# EAGLE design GSM Schematic (EAGLE 7.7.0)
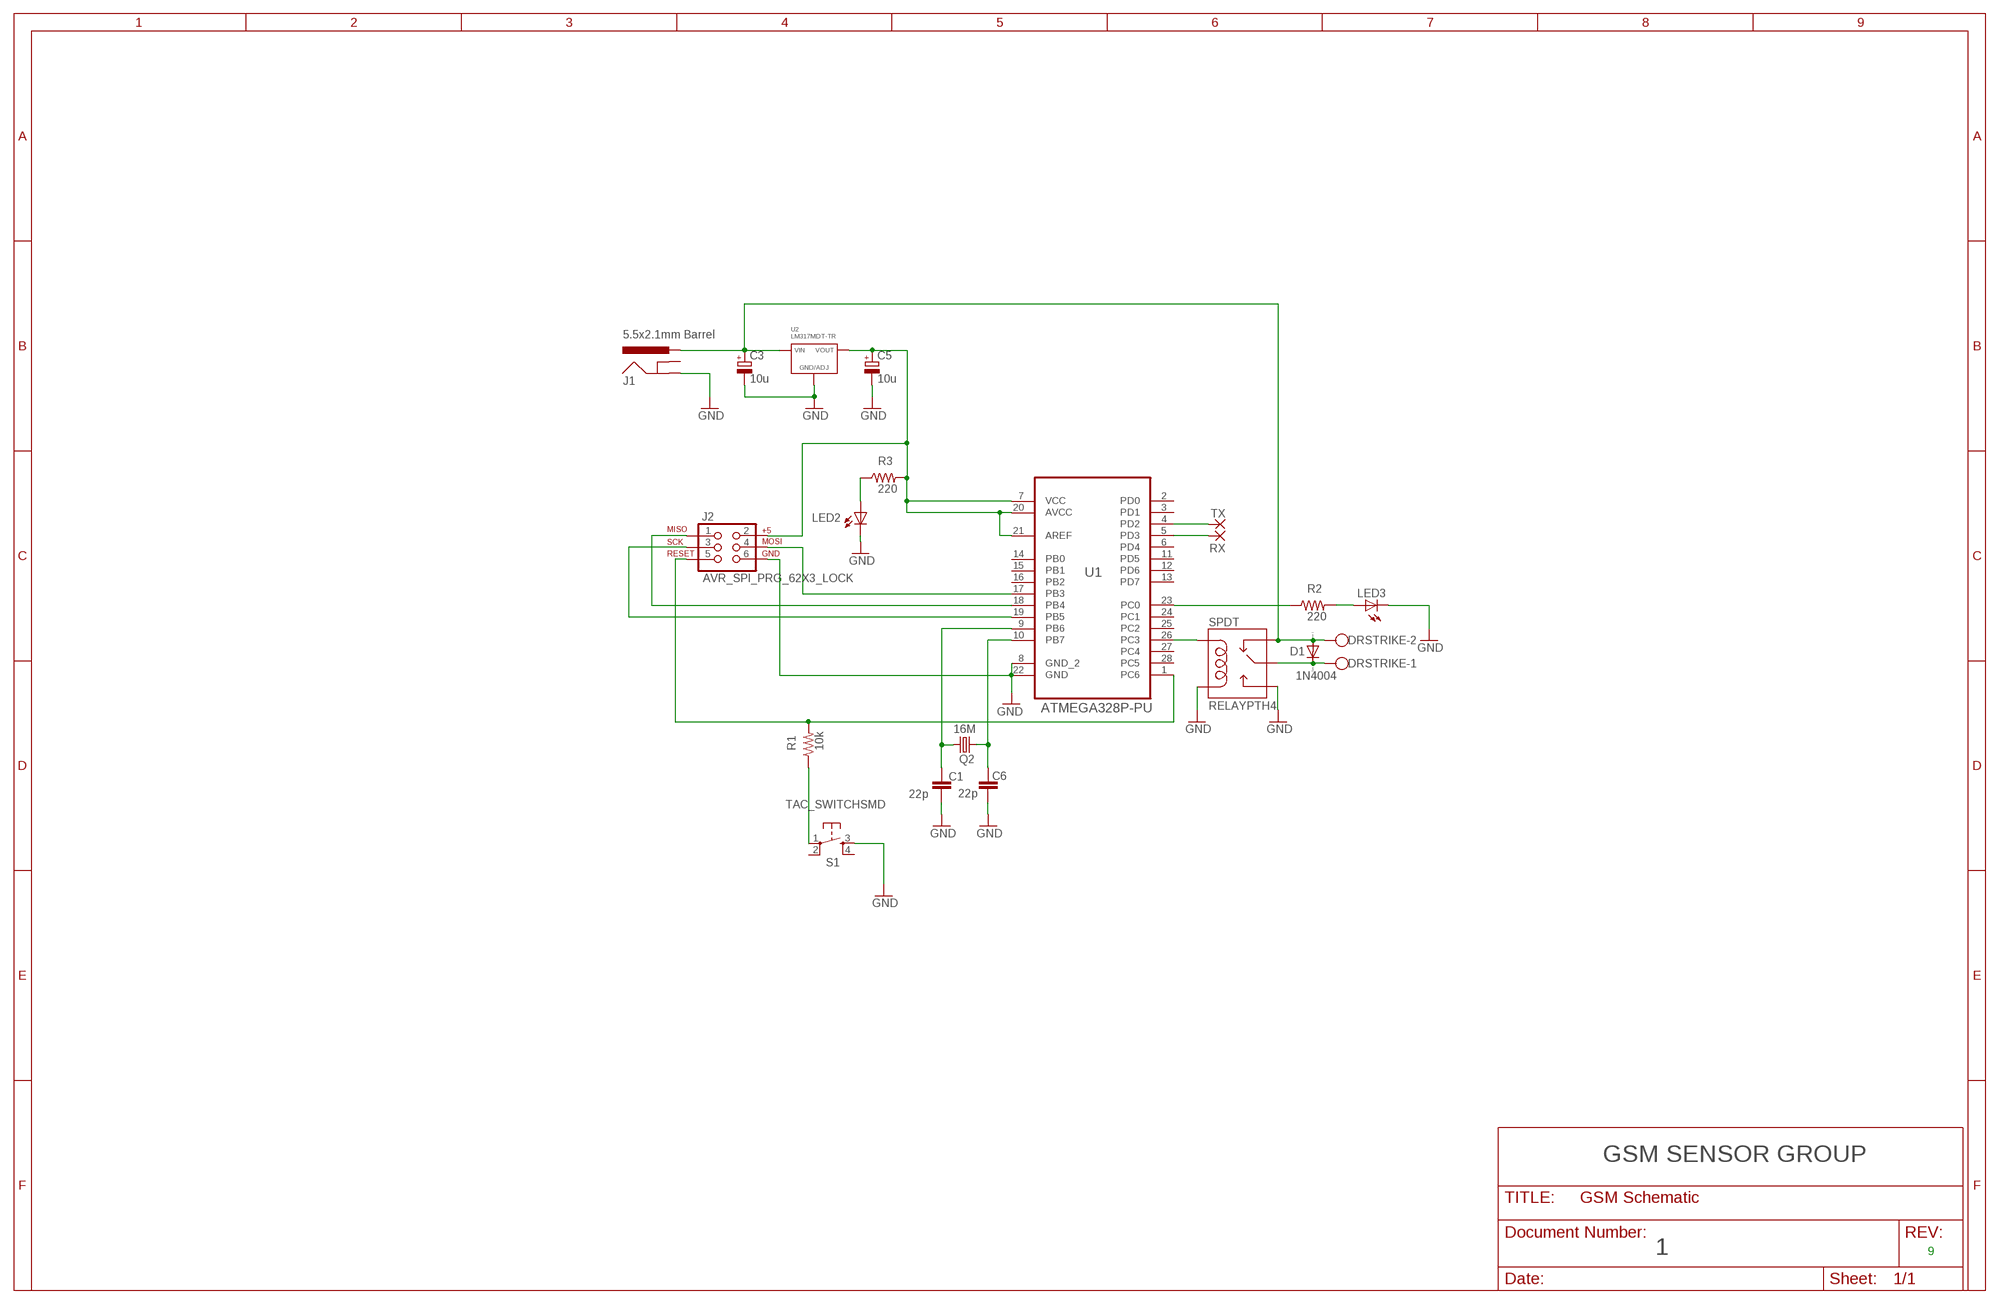
[diagram p0: schematic, sheet 1]

## Parts
C1  22p  C-EUC0603  [C0603]
C3  10u  CPOL-EUE5-10.5  [E5-10,5]
C5  10u  CPOL-EUE5-10.5  [E5-10,5]
C6  22p  C-EUC0603  [C0603]
D1  1N4004  [DO41-10]
DRSTRIKE  W237-102  [W237-102]
J1  5.5x2.1mm Barrel  POWER_JACKSMD  [POWER_JACK_SMD]
J2  AVR_SPI_PRG_62X3_LOCK  [2X3_LOCK]
LED2  LEDSML0603  [SML0603]
LED3  LED5MM  [LED5MM]
Q2  16M  CRYSTALHC49UP  [HC49UP]
R1  10k  R-US_R0603  [R0603]
R2  220  R-US_R0603  [R0603]
R3  220  R-US_R0603  [R0603]
RX  2,54/0,9  [2,54/0,9]
S1  TAC_SWITCHSMD  [TACTILE-SWITCH-SMD]
SPDT  RELAYPTH4  [RELAY-JZC]
TX  2,54/0,9  [2,54/0,9]
U1  ATMEGA328P-PU  [DIP254P762X457-28]
U2  LM317MDT-TR  [TO-252-3]

## Nets
5V: C5.+ J2.2 R3.2 U1.7(VCC) U1.20(AVCC) U1.21(AREF) U2.PAD(VOUT)
12V: C3.+ D1.A DRSTRIKE.2 J1.VIN0(PWR) SPDT.2(NC) U2.2(VIN)
GND: C1.2 C3.- C5.- C6.2 J1.P$4(GND) J2.6 LED2.C LED3.K(C) S1.3 SPDT.1(COIL2) SPDT.3(NO) U1.8(GND_2) U1.22(GND) U2.1(GND/ADJ)
N$1: TX.1(P) U1.4(PD2)
N$2: R1.1 S1.1
N$3: LED2.A R3.1
N$4: D1.C DRSTRIKE.1 SPDT.4(MAIN)
N$5: J2.3 U1.19(PB5)
N$6: LED3.A R2.2
N$7: J2.4 U1.17(PB3)
N$8: J2.1 U1.18(PB4)
N$9: R2.1 U1.23(PC0)
N$10: J2.5 R1.2 U1.1(PC6)
N$12: RX.1(P) U1.5(PD3)
N$14: SPDT.5(COIL1) U1.26(PC3)
N$16: C1.1 Q2.2 U1.9(PB6)
N$18: C6.1 Q2.1 U1.10(PB7)
Unconnected: J1.GND(GNDBREAK) S1.2 S1.4 U1.2(PD0) U1.3(PD1) U1.6(PD4) U1.11(PD5) U1.12(PD6) U1.13(PD7) U1.14(PB0) U1.15(PB1) U1.16(PB2) U1.24(PC1) U1.25(PC2) U1.27(PC4) U1.28(PC5)

## Notes on the sheet
- GSM SENSOR GROUP
- 1 | 9

## Library data of the parts
C1 C6 = rcl:C-EU: CAPACITOR, European symbol
C3 C5 = rcl:CPOL-EU: POLARIZED CAPACITOR, European symbol
D1 = diode:1N4004: DIODE general purpose rectifier, 1 A
DRSTRIKE = con-wago-500:W237-102: WAGO SCREW CLAMP; MPN: 237-102; OC_FARNELL: unknown; OC_NEWARK: 70K9898
J1 = SparkFun-Connectors:POWER_JACK: Power Jack This is the standard 5.5mm barrel jack for power. The PTH is the most common, proven, reliable, footprint. The Slot footprint only works if the mill layer is transmitted to the PCB fab house so be warned. Mating wall wart : TOL-00298 (and others); PROD_ID: CONN-08106; SF_ID: PRT-12748
J2 = SparkFun-Connectors:AVR_SPI_PRG_6: AVR ISP 6 Pin This is the reduced ISP connector for AVR programming. Common on Arduino. This footprint will take up less PCB space and can be used with a 10-pin to 6-pin adapter such as SKU: BOB-08508 **Special note about "TEST_POINT" package. The stop mask is on the top side, so if you want your programming test points to be on the bottom of your board, make sure to place this package on the bottom side of the board. This also ensure that the orientation to program from the bottom side will be correct.
LED2 LED3 = led:LED: LED OSRAM: - CHIPLED LG R971, LG N971, LY N971, LG Q971, LY Q971, LO R971, LY R971 LH N974, LH R974 LS Q976, LO Q976, LY Q976 LO Q996 - Hyper CHIPLED LW Q18S LB Q993, LB Q99A, LB R99A - SideLED LS A670, LO A670, LY A670, LG A670, LP A670 LB A673, LV A673, LT A673, LW A673 LH A674 LY A675 LS A676, LA A676, LO A676, LY A676, LW A676 LS A679, LY A679, LG A679 - Hyper Micro SIDELED® LS Y876, LA Y876, LO Y876, LY Y876 LT Y87S - SmartLED LW L88C, LW L88S LB L89C, LB L89S, LG L890 LS L89K, LO L89K, LY L89K LS L896, LA L896, LO L896, LY L896 - TOPLED LS T670, LO T670, LY T670, LG T670, LP T670 LSG T670, LSP T670, LSY T670, LOP T670, LYG T670 LG T671, LOG T671, LSG T671 LB T673, LV T673, LT T673, LW T673 LH T674 LS T676, LA T676, LO T676, LY T676, LB T676, LH T676, LSB T676, LW T676 LB T67C, LV T67C, LT T67C, LS T67K, LO T67K, LY T67K, LW E67C LS E67B, LA E67B, LO E67B, LY E67B, LB E67C, LV E67C, LT E67C LW T67C LS T679, LY T679, LG T679 LS T770, LO T770, LY T770, LG T770, LP T770 LB T773, LV T773, LT T773, LW T773 LH T774 LS E675, LA E675, LY E675, LS T675 LS T776, LA T776, LO T776, LY T776, LB T776 LHGB T686 LT T68C, LB T68C - Hyper Mini TOPLED® LB M676 - Mini TOPLED Santana® LG M470 LS M47K, LO M47K, LY M47K Source: http://www.osram.convergy.de LUXEON: - LUMILED® LXK2-PW12-R00, LXK2-PW12-S00, LXK2-PW14-U00, LXK2-PW14-V00 LXK2-PM12-R00, LXK2-PM12-S00, LXK2-PM14-U00 LXK2-PE12-Q00, LXK2-PE12-R00, LXK2-PE12-S00, LXK2-PE14-T00, LXK2-PE14-U00 LXK2-PB12-K00, LXK2-PB12-L00, LXK2-PB12-M00, LXK2-PB14-N00, LXK2-PB14-P00, LXK2-PB14-Q00 LXK2-PR12-L00, LXK2-PR12-M00, LXK2-PR14-Q00, LXK2-PR14-R00 LXK2-PD12-Q00, LXK2-PD12-R00, LXK2-PD12-S00 LXK2-PH12-R00, LXK2-PH12-S00 LXK2-PL12-P00, LXK2-PL12-Q00, LXK2-PL12-R00 Source: www.luxeon.com KINGBRIGHT: KA-3528ASYC Source: www.kingbright.com
Q2 = crystal:CRYSTAL: CRYSTAL; OC_FARNELL: unknown; OC_NEWARK: unknown
R1-R3 = rcl:R-US_: RESISTOR, American symbol
RX TX = wirepad:2,54/0,9: THROUGH-HOLE PAD
S1 = SparkFun-Retired:TAC_SWITCH: Momentary Switch Button commonly used for reset or general input. Spark Fun Electronics SKU : COM-00097 SMT- SWCH-08247; PROD_ID: SWCH-08247
SPDT = SparkFun-Electromechanical:RELAY: SPDT relay (COM-00101)
U1 = Atmel_By_element14_Batch_1-00:ATMEGA328P-PU: 8-bit Microcontroller with In-System Programmable Flash; MPN: ATMEGA328P-PU; OC_FARNELL: 1715487; OC_NEWARK: 15R0268; PACKAGE: PDIP-28; SUPPLIER: Atmel
U2 = MF_IC_Power:LM317: Manufacturer Part #: LM317 Manufacturer: STMicroelectronics Description: Linear Voltage Regulators 1.2-37V Adj Positive; HOUSEPART: NO; MPN: LM317MDT-TR; POPULATE: 1; URL: http://www.st.com/content/ccc/resource/technical/document/datasheet/8e/b2/ea/56/ad/8c/43/d8/CD00000549.pdf/files/CD00000549.pdf/jcr:content/translations/en.CD00000549.pdf

## Board
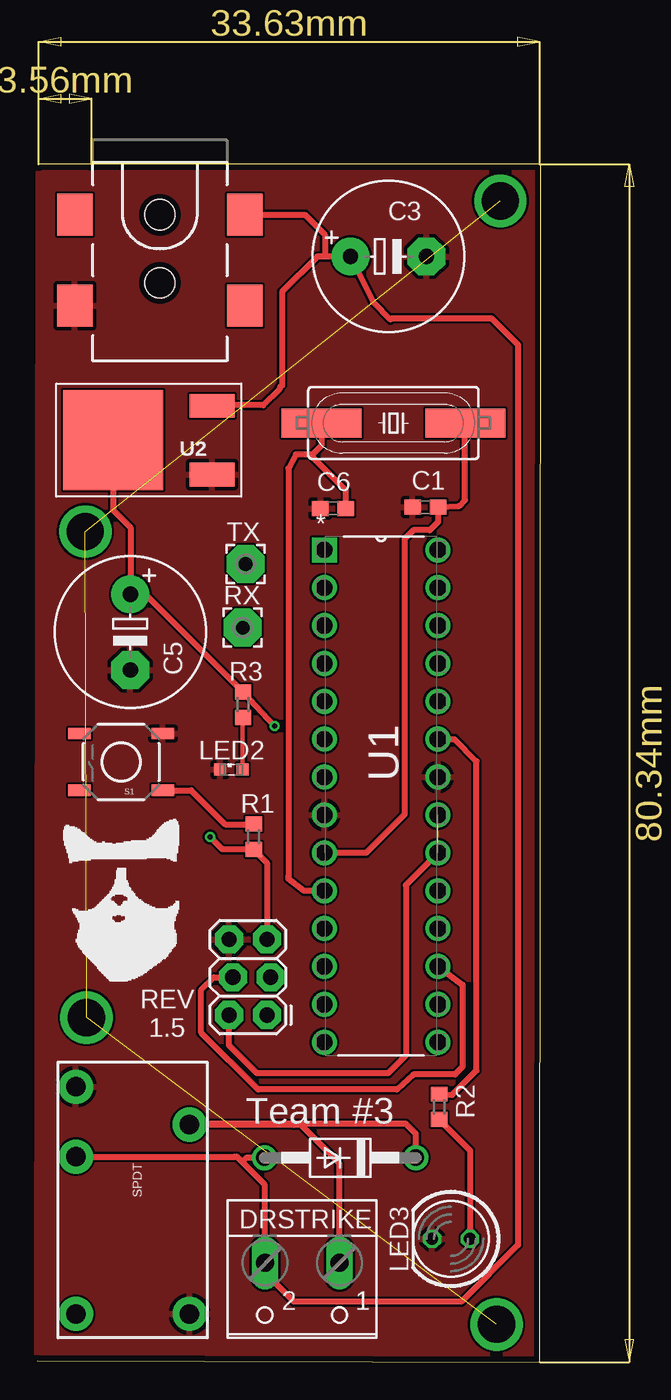
[diagram p1: board, top side]
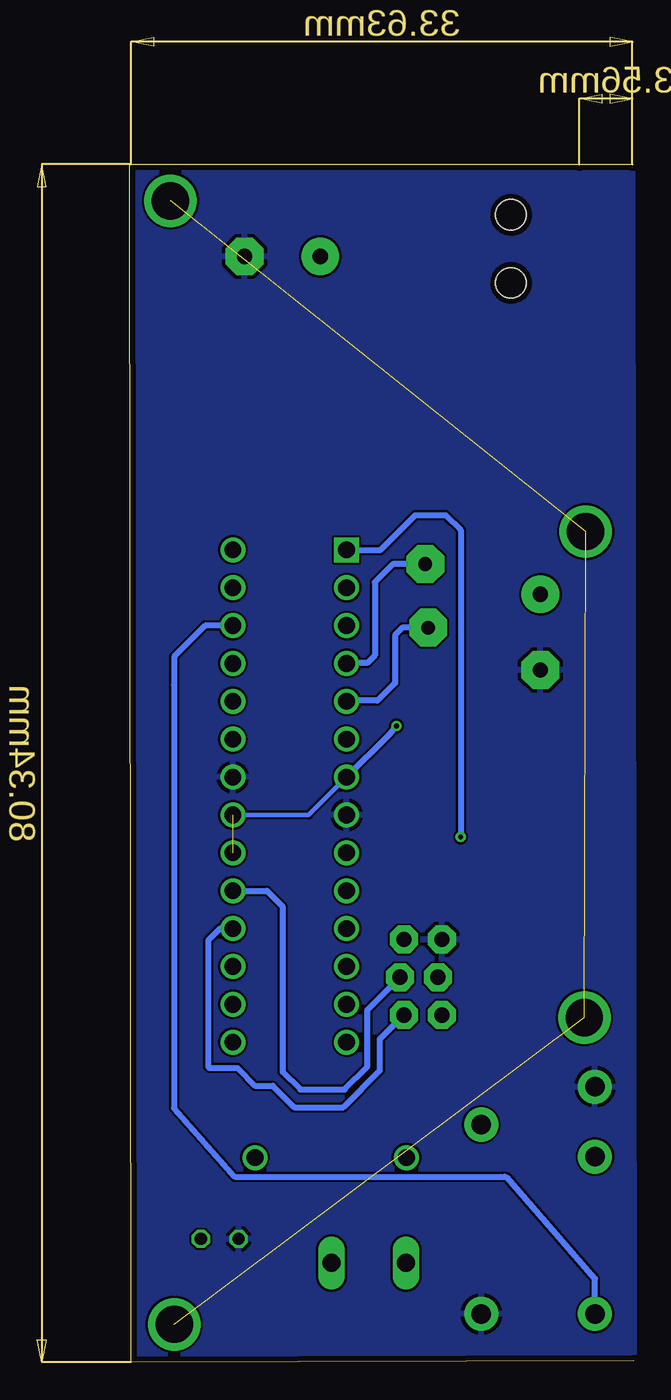
[diagram p2: board, bottom side, seen from below]

Size 33.8 x 80.34 mm. Coordinates in mm from the lower left corner, seen from the top.
Outline: 0,0.08 33.71,0 33.8,80.34 0.08,80.34
Copper layers (1*16): Top 0.0356mm / dielectric 1.5011mm / Bottom 0.0356mm
Design rules "OSH-Park-2-layer": minimum track width 6mil, minimum drill 13mil, track to track 6mil, track to pad 6mil, pad to pad 6mil, via to via 6mil, smd to smd 6mil, copper to edge 15mil, drill to drill 6mil, minimum pad ring 7mil, minimum via ring 7mil, stop-mask expansion 3mil, vias tented up to drill 0mil, thermal gap 10mil

### Footprints (pad centres in the part's own frame; a part is rotated, then mirrored left to right if it is on the bottom)
C0603 = smd 1.1 x 1: 1 -0.85,0; 2 0.85,0
E5-10,5 = drill 1.016 pad 2.54: + -2.54,0 | drill 1.016 pad 2.54 octagon: - 2.54,0
DO41-10 = drill 1.118: A 5.08,0; C -5.08,0
W237-102 = drill 1.194 long: 1 -2.5,-1.27; 2 2.5,-1.27
POWER_JACK_SMD = smd 2.8 x 2.4: GND 0,-5.7; P$4 6.1,-5.7; VIN0 0,5.7; VIN1 6.1,5.7 | hole 2.032: 0,0; 4.572,0
2X3_LOCK = drill 1.016 pad 1.88 octagon: 1 0,0; 2 0,2.54; 3 2.54,-0.254; 4 2.54,2.286; 5 5.08,0; 6 5.08,2.54
SML0603 = smd 0.8 x 0.8: A 0.75,0; C -0.75,0
LED5MM = drill 0.813 octagon: A -1.27,0; K 1.27,0
HC49UP = smd 5.334 x 1.93: 1 -4.826,0; 2 4.826,0
R0603 = smd 1 x 1.1: 1 -0.85,0; 2 0.85,0
2,54/0,9 = drill 0.914 pad 2.54 octagon: 1 0,0
TACTILE-SWITCH-SMD = smd 1.524 x 0.762: 1 -2.794,1.905; 2 2.794,1.905; 3 -2.794,-1.905; 4 2.794,-1.905
RELAY-JZC = drill 1.3 pad 2.286: 1 3.81,-8.89; 2 -3.81,1.651; 3 -3.81,6.35; 4 3.81,3.81; 5 -3.81,-8.89
DIP254P762X457-28 = drill 1.118 square: 1 -7.62,33.02 | drill 1.118: 2 -7.62,30.48; 3 -7.62,27.94; 4 -7.62,25.4; 5 -7.62,22.86; 6 -7.62,20.32; 7 -7.62,17.78; 8 -7.62,15.24; 9 -7.62,12.7; 10 -7.62,10.16; 11 -7.62,7.62; 12 -7.62,5.08; 13 -7.62,2.54; 14 -7.62,0; 15 0,0; 16 0,2.54; 17 0,5.08; 18 0,7.62; 19 0,10.16; 20 0,12.7; 21 0,15.24; 22 0,17.78; 23 0,20.32; 24 0,22.86; 25 0,25.4; 26 0,27.94; 27 0,30.48; 28 0,33.02
TO-252-3 = smd 3 x 1.6: 1 -6.65,2.3; 2 -6.65,-2.3 | smd 6.7 x 6.7: PAD 0,0

### Placement (x,y rotation side)
C1  26.03,57.35 180 top
C3  23.56,74.16 0 top
C5  6.24,48.96 270 top
C6  19.85,57.26 180 top
D1  20.32,13.71 180 top
DRSTRIKE  17.77,5.39 180 top
J1  8.22,76.95 270 top
J2  15.41,23.28 90 top
LED2  13.02,39.74 0 top
LED3  27.76,8.27 180 top
Q2  23.89,62.99 0 top
R1  14.51,35.24 270 top
R2  26.95,17.13 270 top
R3  13.81,44.1 90 top
RX  13.78,49.26 0 top
S1  5.62,40.26 180 top
SPDT  6.4,12.13 0 top
TX  13.97,53.52 0 top
U1  26.87,21.46 0 top
U2  5.08,61.84 180 top

### Tracks (layer width: path | path; a pad name or v marks a point on that pad's centre or on a via)
5V  (via drill 0.33)  (1 unrouted)
  Top 0.406: v15.92,42.67 R3.2 7.26,51.5 C5.+ 6.26,51.52 6.26,55.96 5.08,57.14 U2.PAD | U1.20 24.72,32 24.72,20.57 23.53,19.39 14.73,19.39 12.87,21.25 J2.2
  Bottom 0.305: U1.7 21.79,36.7 U1.21
  Bottom 0.406: v15.92,42.67 16.42,42.07 U1.7
12V
  Top 0.406: DRSTRIKE.2 15.27,6.01 | 13.76,13.42 13.4,13.78 SPDT.2 13.21,13.78 | 13.76,13.42 15.24,11.94 15.24,6.05 15.27,6.01 | 19.3,74.16 C3.+ 22.54,71.09 23.7,69.93 23.79,70.01 30.48,70.01 32.25,68.23 32.25,7.87 28.44,4.06 17.22,4.06 17.17,4.11 16.86,4.42 15.27,6.01 | 19.3,74.16 18.79,74.16 16.42,71.79 16.42,65.53 16.25,65.36 16.25,65.27 15.15,64.17 12.61,64.17 12.53,64.26 11.85,64.26 U2.2 | J1.VIN0 17.95,76.95 19.3,75.6 19.3,74.16 | D1.A 14.05,13.71 13.76,13.42
GND
  pour Top: 0.08,80.34 33.71,80.34 33.71,0 0,0.08
  pour Bottom: 0.08,80.34 0,0.08 33.71,0 33.71,80.34
MHOLES  (via drill 2.5)  (3 unrouted)
  other vias: 31.07,77.89 30.82,2.54 3.3,23.11 3.22,55.71
N$1
  Bottom 0.406: TX.1 16.15,53.52 17.35,52.32 17.35,47.41 17.86,46.9 19.21,46.9 U1.4
N$2
  Top 0.406: S1.1 10.33,38.35 12.61,36.06 14.49,36.06 R1.1
N$3
  Top 0.305: R3.1 13.77,43.21 LED2.A
N$4
  Top 0.406: 17.19,15.94 SPDT.4 10.28,16 24.72,16 25.4,15.32 D1.C | 17.19,15.94 17.67,15.94 20.23,13.38 20.23,6.7 DRSTRIKE.1 | 17.21,15.92 17.19,15.94
N$5
  Bottom 0.406: U1.19 24.59,31.62 23.53,30.56 23.53,19.47 22.35,18.29 19.39,18.29 17.86,19.81 17.86,23.62 J2.3
N$6
  Top 0.406: R2.2 29.03,14.2 LED3.A
N$7
  Top 0.406: U1.17 28.53,25.31 28.53,19.81 28.02,19.3 25.23,19.3 24.13,18.29 14.82,18.29 11.01,22.1 11.01,24.97 11.85,25.82 J2.4
N$8
  Bottom 0.406: U1.18 27.73,29.08 28.53,28.28 28.53,19.81 28.44,19.73 26.58,19.73 25.4,18.54 24.21,18.54 22.77,17.1 19.47,17.1 17.02,19.56 17.02,21.67 J2.1
N$9
  Top 0.406: R2.1 27.82,17.92 29.46,19.56 29.46,40.3 27.98,41.78 U1.23
N$10  (via drill 0.33)
  Top 0.406: v11.6,35.22 12.43,34.39 R1.2 15.41,33.5 J2.5
  Bottom 0.406: U1.1 16.97,54.48 14.65,56.81 12.61,56.81 11.6,55.79 v11.6,35.22
N$12
  Bottom 0.406: RX.1 15.5,49.26 16,48.76 16,45.55 17.19,44.36 19.21,44.36 U1.5
N$14
  Bottom 0.406: SPDT.5 2.59,5.6 8.5,12.39 | 8.5,12.39 8.92,12.43 | 8.5,12.39 8.64,12.44 26.75,12.44 30.83,17.04 30.83,45.44 30.82,45.46 30.82,47.32 28.74,49.4 U1.26
N$16
  Top 0.406: U1.9 22.05,34.16 22.39,34.5 23.11,35.22 24.64,36.74 24.64,55.2 25.23,55.79 26.33,55.79 26.88,56.34 C1.1 28.31,57.43 28.7,57.82 28.7,62.97 Q2.2
N$18
  Top 0.406: 19.07,62.58 Q2.1 19.07,61.48 18.46,60.87 18.29,60.87 | 20.74,57.3 C6.1 20.7,58.46 18.29,60.87 | 18.29,60.87 17.35,60.87 16.85,59.94 16.85,32.59 16.85,32.42 17.91,31.62 U1.10

### Text on the board
tPlace: REV / 1.5 | Team #3